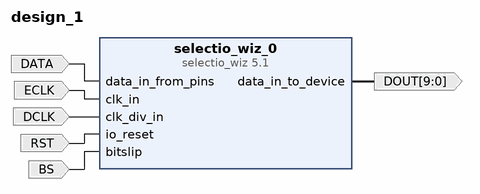
[diagram p0: block diagram of the top level]
# Vivado block design design_1, xc7z020clg400-1, Vivado 2019.1
create_bd_design design_1

create_bd_port -dir I DATA
create_bd_port -dir I ECLK
create_bd_port -dir I DCLK
create_bd_port -dir I RST
create_bd_port -dir O -from 9 -to 0 DOUT
create_bd_port -dir I BS

create_bd_cell -type ip -vlnv xilinx.com:ip:selectio_wiz:5.1 selectio_wiz_0
set_property -dict [list \
  CONFIG.BUS_IO_STD LVCMOS33 \
  CONFIG.CLK_FWD_IO_STD LVCMOS33 \
  CONFIG.SELIO_ACTIVE_EDGE DDR \
  CONFIG.SELIO_CLK_BUF MMCM \
  CONFIG.SELIO_CLK_IO_STD LVCMOS33 \
  CONFIG.SELIO_INTERFACE_TYPE NETWORKING \
  CONFIG.SERIALIZATION_FACTOR 10 \
  CONFIG.SYSTEM_DATA_WIDTH 1 \
  CONFIG.USE_SERIALIZATION true \
] [get_bd_cells selectio_wiz_0]

# ---- connections ----

connect_bd_net [get_bd_ports DATA] [get_bd_pins selectio_wiz_0/data_in_from_pins]
connect_bd_net [get_bd_ports ECLK] [get_bd_pins selectio_wiz_0/clk_in]
connect_bd_net [get_bd_ports DCLK] [get_bd_pins selectio_wiz_0/clk_div_in]
connect_bd_net [get_bd_ports RST] [get_bd_pins selectio_wiz_0/io_reset]
connect_bd_net [get_bd_pins selectio_wiz_0/data_in_to_device] [get_bd_ports DOUT]
connect_bd_net [get_bd_ports BS] [get_bd_pins selectio_wiz_0/bitslip]

validate_bd_design
save_bd_design
